# Altium schematic sheet Sheet3.SchDoc
size A3
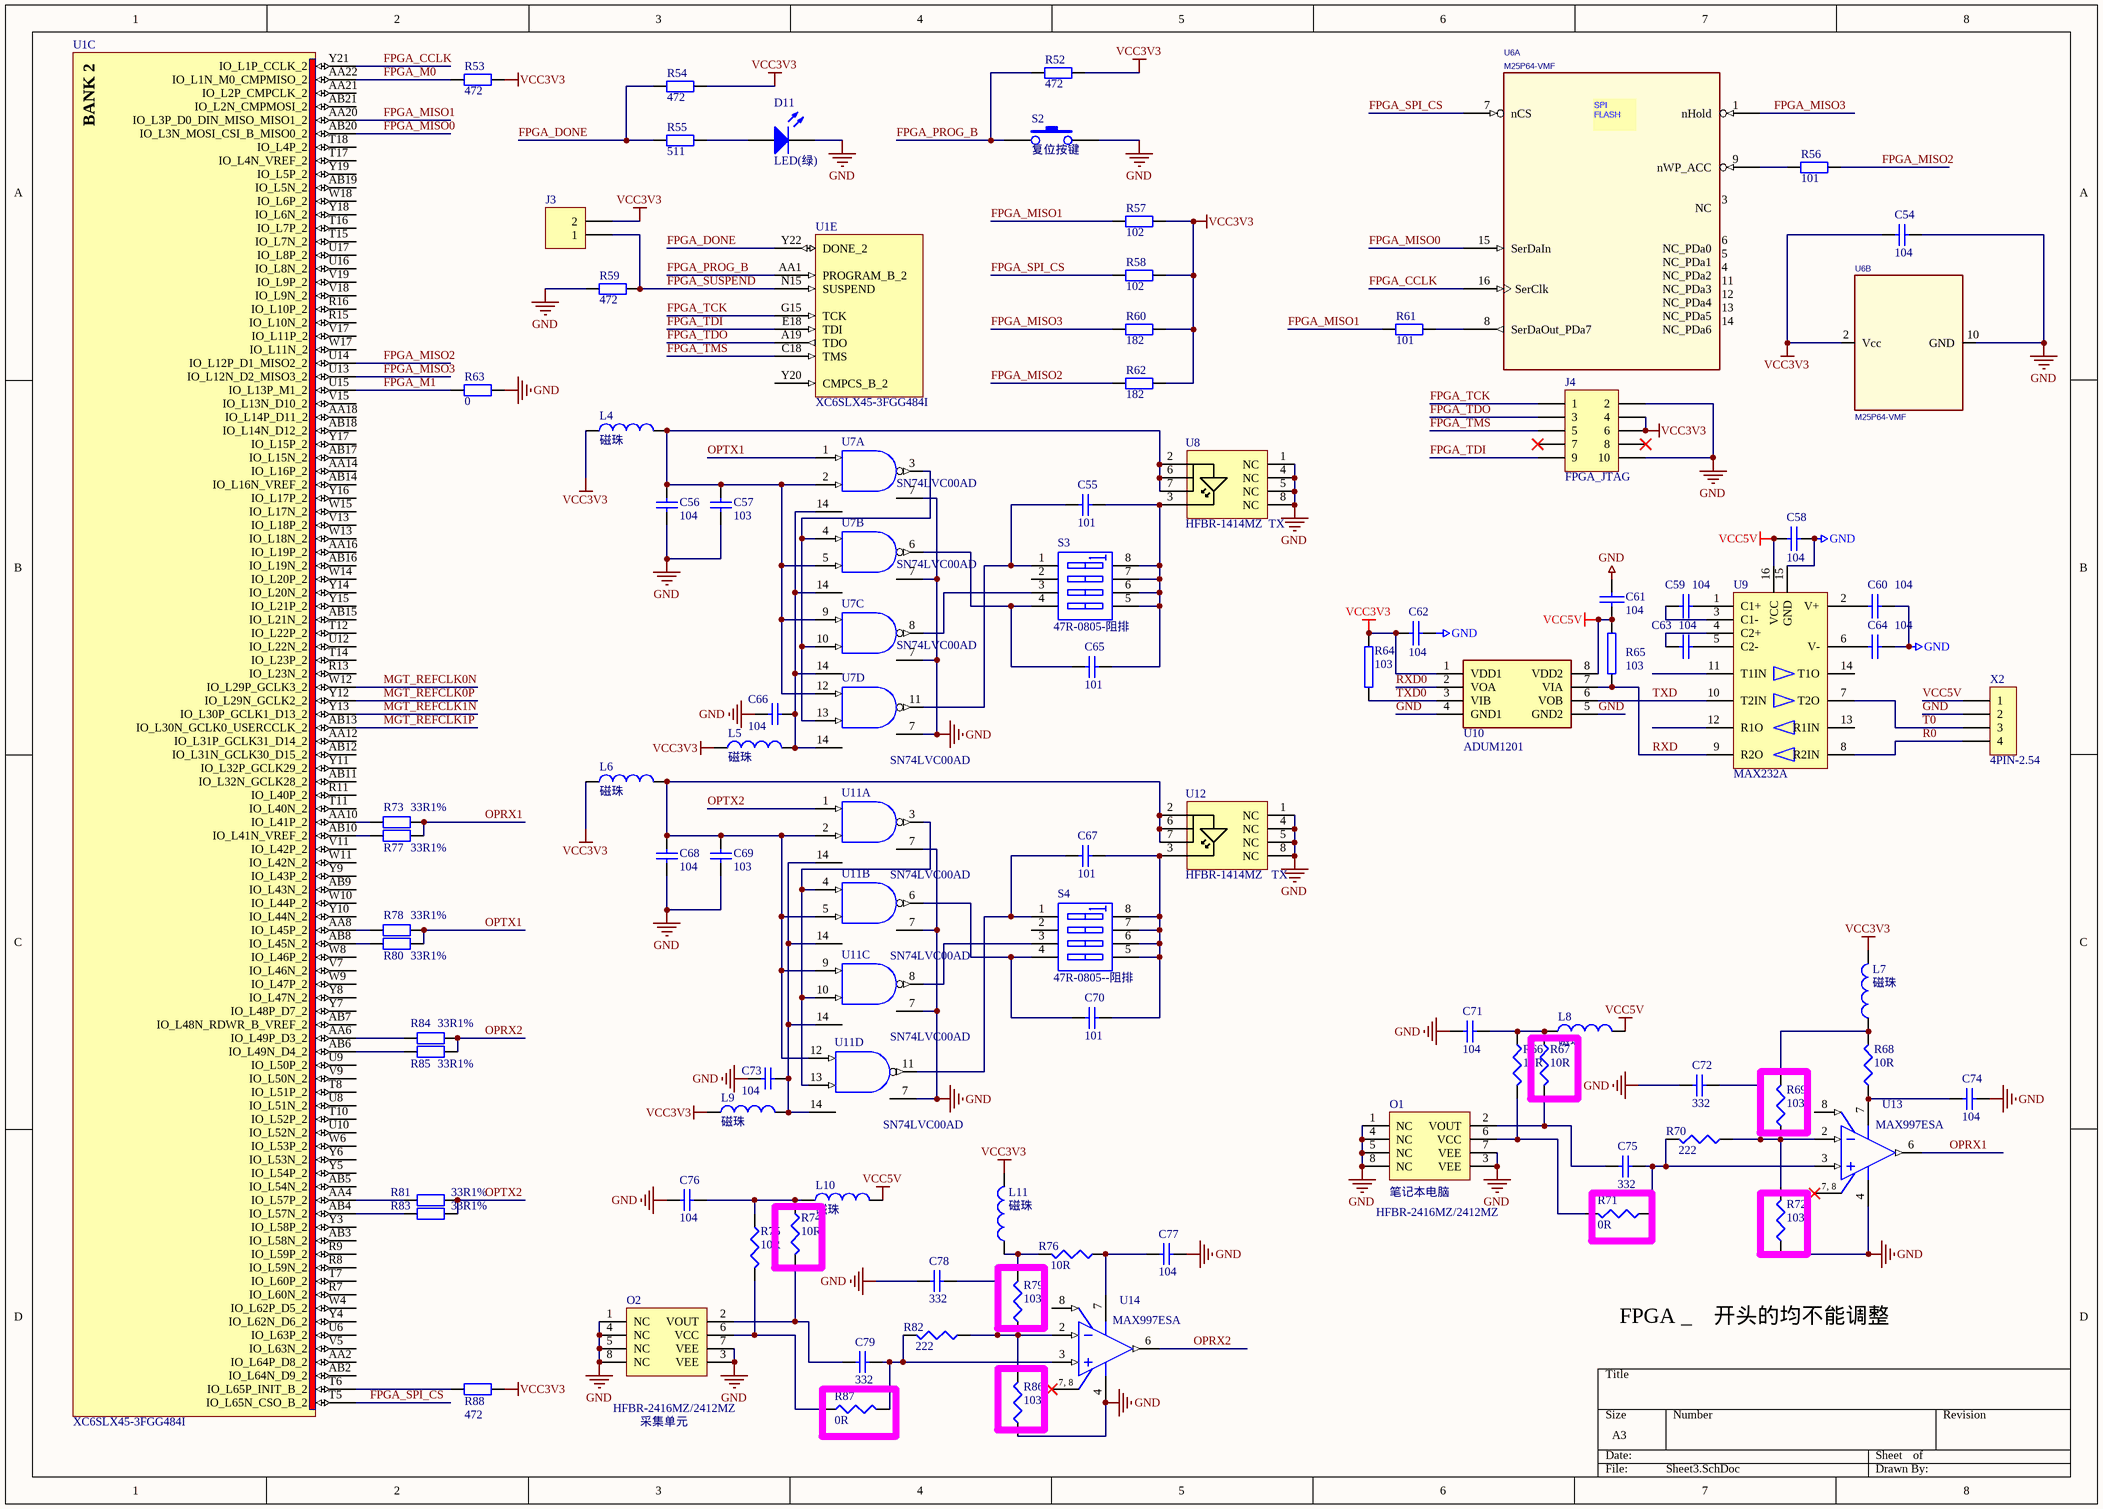
[diagram p0: Sheet3.SchDoc]

## Parts
C54  104  [0402]
C55  101  [0603]
C56  104  [0603]
C57  103  [0603]
C58  104  [0603]
C59  104  [0603]
C60  104  [0603]
C61  104  [0603]
C62  104  [0603]
C63  104  [0603]
C64  104  [0603]
C65  101  [0603]
C66  104  [0603]
C67  101  [0603]
C68  104  [0603]
C69  103  [0603]
C70  101  [0603]
C71  104  [0603]
C72  332  [0603]
C73  104  [0603]
C74  104  [0603]
C75  332  [0603]
C76  104  [0603]
C77  104  [0603]
C78  332  [0603]
C79  332  [0603]
D11  LED(绿)  [0805LED]
J3  (no value)  [HDR1X2]
J4  FPGA_JTAG  [HDR2X5]
L4  磁珠  [1206A]
L5  磁珠  [1206A]
L6  磁珠  [1206A]
L7  磁珠  [1206A]
L8  磁珠  [1206A]
L9  磁珠  [1206A]
L10  磁珠  [1206A]
L11  磁珠  [1206A]
O1  HFBR-2416MZ/2412MZ  [OPT]
O2  HFBR-2416MZ/2412MZ  [OPT]
R52  472  [0603]
R53  472  [0603]
R54  472  [0603]
R55  511  [0603]
R56  101  [0603]
R57  102  [0603]
R58  102  [0603]
R59  472  [0603]
R60  182  [0603]
R61  101  [0603]
R62  182  [0603]
R63  0  [0603]
R64  103  [0603]
R65  103  [0603]
R66  10R  [0603]
R67  10R  [0603]
R68  10R  [0603]
R69  103  [0603]
R70  222  [0603]
R71  0R  [0603]
R72  103  [0603]
R73  33R1%  [0402]
R74  10R  [0603]
R75  10R  [0603]
R76  10R  [0603]
R77  33R1%  [0402]
R78  33R1%  [0402]
R79  103  [0603]
R80  33R1%  [0402]
R81  33R1%  [0402]
R82  222  [0603]
R83  33R1%  [0402]
R84  33R1%  [0402]
R85  33R1%  [0402]
R86  103  [0603]
R87  0R  [0603]
R88  472  [0603]
S2  复位按键  [RESETKEY]
S3  47R-0805-阻排  [RNS001]
S4  47R-0805--阻排  [RNS001]
U1  XC6SLX45-3FGG484I  [FGG484]  (parts C,E of 8)
U6  M25P64-VMF  [SOIC16]  (parts A,B of 2)
U7  SN74LVC00AD  [SMD14X]  (parts A,B,C,D of 4)
U8  HFBR-1414MZ  TX  [OPT]
U9  MAX232A  [SMD16XX]
U10  ADUM1201  [SMD8XX]
U11  SN74LVC00AD  [SMD14X]  (parts A,B,C,D of 4)
U12  HFBR-1414MZ   TX  [OPT]
U13  MAX997ESA  [SMD8XX]
U14  MAX997ESA  [SMD8XX]
X2  4PIN-2.54  [SIP4X]

## Nets
GND: C54.1 C56.2 C57.1 C58.1 C60.1 C61.2 C62.2 C64.1 C66.2 C68.2 C69.1 C71.2 C72.2 C73.2 C74.2 C76.2 C77.2 C78.2 D11.2(K) J4.2 J4.10 O1.1(NC) O1.3(VEE) O1.4(NC) O1.5(NC) O1.7(VEE) O1.8(NC) O2.1(NC) O2.3(VEE) O2.4(NC) O2.5(NC) O2.7(VEE) O2.8(NC) R59.1 R63.2 R72.1 R86.1 S2.2 U6.10(GND) U7.7(GND) U8.1(NC) U8.4(NC) U8.5(NC) U8.8(NC) U9.15(GND) U10.4(GND1) U10.5(GND2) U11.7(GND) U12.1(NC) U12.4(NC) U12.5(NC) U12.8(NC) U13.4(GND) U14.4(GND) X2.2
VCC: C66.1 C73.1 L5.2 L9.2 U7.14(VCC) U11.14(VCC)
VCC3V3: C54.2 C62.1 J3.2 J4.4 J4.6 L4.1 L5.1 L6.1 L7.2 L9.1 L11.2 R52.2 R53.2 R54.2 R57.2 R58.2 R60.2 R62.2 R64.2 R88.2 U6.2(Vcc) U10.1(VDD1)
VCC5V: C58.2 C61.1 L8.2 L10.2 R65.2 U9.16(VCC) U10.8(VDD2) X2.1
FPGA_CCLK: U1.Y21(IO_L1P_CCLK_2) U6.16(SerClk)
FPGA_DONE: R54.1 R55.1 U1.Y22(DONE_2)
FPGA_M0: R53.1 U1.AA22(IO_L1N_M0_CMPMISO_2)
FPGA_M1: R63.1 U1.U15(IO_L13P_M1_2)
FPGA_MISO0: U1.AB20(IO_L3N_MOSI_CSI_B_MISO0_2) U6.15(SerDaIn)
FPGA_MISO1: R57.1 R61.1 U1.AA20(IO_L3P_D0_DIN_MISO_MISO1_2)
FPGA_MISO2: R56.2 R62.1 U1.U14(IO_L12P_D1_MISO2_2)
FPGA_MISO3: R60.1 U1.U13(IO_L12N_D2_MISO3_2) U6.1(nHold)
FPGA_PROG_B: R52.1 S2.1 U1.AA1(PROGRAM_B_2)
FPGA_SPI_CS: R58.1 U1.T5(IO_L65N_CSO_B_2) U6.7(nCS)
FPGA_SUSPEND: J3.1 R59.2 U1.N15(SUSPEND)
FPGA_TCK: J4.1 U1.G15(TCK)
FPGA_TDI: J4.9 U1.E18(TDI)
FPGA_TDO: J4.3 U1.A19(TDO)
FPGA_TMS: J4.5 U1.C18(TMS)
MGT_REFCLK0N: U1.W12(IO_L29P_GCLK3_2)
MGT_REFCLK0P: U1.Y12(IO_L29N_GCLK2_2)
MGT_REFCLK1N: U1.Y13(IO_L30P_GCLK1_D13_2)
MGT_REFCLK1P: U1.AB13(IO_L30N_GCLK0_USERCCLK_2)
OPRX1: R73.1 R77.1 U13.6(OUT)
OPRX2: R84.1 R85.1 U14.6(OUT)
OPTX1: R78.1 R80.1 U7.1(A)
OPTX2: R81.1 R83.1 U11.1(A)
R0: U9.8(R2IN) X2.4
RXD: R65.1 U9.9(R2O) U10.7(VIA)
RXD0: U10.2(VOA)
T0: U9.7(T2O) X2.3
TXD: U9.10(T2IN) U10.6(VOB)
TXD0: R64.1 U10.3(VIB)
NetC55_1: C55.1 C65.1 S3.5(B4) S3.6(B3) S3.7(B2) S3.8(B1) U8.3
NetC55_2: C55.2 S3.1(A1) U7.11(Y)
NetC56_1: C56.1 C57.2 L4.2 U7.2(B) U7.5(B) U7.9(A) U7.12(A) U8.2 U8.6 U8.7
NetC59_1: C59.1 U9.1(C1+)
NetC59_2: C59.2 U9.3(C1-)
NetC60_2: C60.2 U9.2(V+)
NetC63_1: C63.1 U9.5(C2-)
NetC63_2: C63.2 U9.4(C2+)
NetC64_2: C64.2 U9.6(V-)
NetC65_2: C65.2 S3.4(A4) U7.6(Y)
NetC67_1: C67.1 C70.1 S4.5(B4) S4.6(B3) S4.7(B2) S4.8(B1) U12.3
NetC67_2: C67.2 S4.1(A1) U11.11(Y)
NetC68_1: C68.1 C69.2 L6.2 U11.2(B) U11.5(B) U11.9(A) U11.12(A) U12.2 U12.6 U12.7
NetC70_2: C70.2 S4.4(A4) U11.6(Y)
NetC71_1: C71.1 L8.1 R66.1 R67.1
NetC72_1: C72.1 R69.1 R70.1 R72.2 U13.2(IN-)
NetC74_1: C74.1 R68.1 U13.7(VCC)
NetC75_1: C75.1 R70.2 R71.1 U13.3(IN+)
NetC75_2: C75.2 O1.2(VOUT) R67.2
NetC76_1: C76.1 L10.1 R74.1 R75.1
NetC77_1: C77.1 R76.1 U14.7(VCC)
NetC78_1: C78.1 R79.1 R82.1 R86.2 U14.2(IN-)
NetC79_1: C79.1 R82.2 R87.2 U14.3(IN+)
NetC79_2: C79.2 O2.2(VOUT) R74.2
NetD11_1: D11.1(A) R55.2
NetL7_1: L7.1 R68.2 R69.2
NetL11_1: L11.1 R76.2 R79.2
NetO1_6: O1.6(VCC) R66.2 R71.2
NetO2_6: O2.6(VCC) R75.2 R87.1
NetR56_1: R56.1 U6.9(nWP_ACC)
NetR61_2: R61.2 U6.8(SerDaOut_PDa7)
NetR73_2: R73.2 U1.AA10(IO_L41P_2)
NetR77_2: R77.2 U1.AB10(IO_L41N_VREF_2)
NetR78_2: R78.2 U1.AA8(IO_L45P_2)
NetR80_2: R80.2 U1.AB8(IO_L45N_2)
NetR81_2: R81.2 U1.AA4(IO_L57P_2)
NetR83_2: R83.2 U1.AB4(IO_L57N_2)
NetR84_2: R84.2 U1.AA6(IO_L49P_D3_2)
NetR85_2: R85.2 U1.AB6(IO_L49N_D4_2)
NetR88_1: R88.1 U1.T6(IO_L65P_INIT_B_2)
NetS3_3: S3.3(A3) U7.8(Y)
NetS4_3: S4.3(A3) U11.8(Y)
NetU7_3: U7.3(Y) U7.4(A) U7.10(B) U7.13(B)
NetU11_3: U11.3(Y) U11.4(A) U11.10(B) U11.13(B)
NetU13_1: U13.1(NC) U13.5(NC)
NetU14_1: U14.1(NC) U14.5(NC)

Not connected (* = marked no-connect by the designer): J4 7* 8*; S3 2(A2); S4 2(A2); U1 AA2(IO_L64P_D8_2) AA12(IO_L31P_GCLK31_D14_2) AA14(IO_L16P_2) AA16(IO_L19P_2) AA18(IO_L14P_D11_2) AA21(IO_L2P_CMPCLK_2) AB2(IO_L64N_D9_2) AB3(IO_L58N_2) AB5(IO_L54N_2) AB7(IO_L48N_RDWR_B_VREF_2) AB9(IO_L43N_2) AB11(IO_L32N_GCLK28_2) AB12(IO_L31N_GCLK30_D15_2) AB14(IO_L16N_VREF_2) AB15(IO_L21N_2) AB16(IO_L19N_2) AB17(IO_L15N_2) AB18(IO_L14N_D12_2) AB19(IO_L5N_2) AB21(IO_L2N_CMPMOSI_2) R7(IO_L60N_2) R8(IO_L59N_2) R9(IO_L59P_2) R11(IO_L40P_2) R13(IO_L23N_2) R15(IO_L10N_2) R16(IO_L10P_2) T7(IO_L60P_2) T8(IO_L51P_2) T10(IO_L52P_2) T11(IO_L40N_2) T12(IO_L22P_2) T14(IO_L23P_2) T15(IO_L7N_2) T16(IO_L7P_2) T17(IO_L4N_VREF_2) T18(IO_L4P_2) U6(IO_L63P_2) U8(IO_L51N_2) U9(IO_L50P_2) U10(IO_L52N_2) U12(IO_L22N_2) U16(IO_L8N_2) U17(IO_L8P_2) V5(IO_L63N_2) V7(IO_L46N_2) V9(IO_L50N_2) V11(IO_L42P_2) V13(IO_L18P_2) V15(IO_L13N_D10_2) V17(IO_L11P_2) V18(IO_L9N_2) V19(IO_L9P_2) W4(IO_L62P_D5_2) W6(IO_L53P_2) W8(IO_L46P_2) W9(IO_L47P_2) W10(IO_L44P_2) W11(IO_L42N_2) W13(IO_L18N_2) W14(IO_L20P_2) W15(IO_L17N_2) W17(IO_L11N_2) W18(IO_L6P_2) Y3(IO_L58P_2) Y4(IO_L62N_D6_2) Y5(IO_L54P_2) Y6(IO_L53N_2) Y7(IO_L48P_D7_2) Y8(IO_L47N_2) Y9(IO_L43P_2) Y10(IO_L44N_2) Y11(IO_L32P_GCLK29_2) Y14(IO_L20N_2) Y15(IO_L21P_2) Y16(IO_L17P_2) Y17(IO_L15P_2) Y18(IO_L6N_2) Y19(IO_L5P_2) Y20(CMPCS_B_2); U6 3(NC) 4(NC_PDa2) 5(NC_PDa1) 6(NC_PDa0) 11(NC_PDa3) 12(NC_PDa4) 13(NC_PDa5) 14(NC_PDa6); U9 11(T1IN) 12(R1O) 13(R1IN) 14(T1O); U13 8(~{SHDN}); U14 8(~{SHDN})

## Notes on the sheet
- (near O1) 笔记本电脑
- FPGA _    开头的均不能调整
- 采集单元
- (in symbol MAX998ESA) 7, 8
- (in symbol SPI FLASH 128Mb S25FL128P, part A) SPI / FLASH
- (in symbol XC6SLX45-3FGG484I, part C) BANK 2

## Library data of the parts
C54 C66 C73 C74 C77 = Cap: Capacitor; Value: 0.1uF; Published: 8-Jun-2000; LatestRevisionDate: 17-Jul-2002; LatestRevisionNote: Re-released for DXP Platform.; PackageReference: RAD-0.3; Publisher: Altium Limited
C55 C65 C67 C70 = Cap Semi: Capacitor (Semiconductor SIM Model); Value: ?uF; Published: 8-Jun-2000; LatestRevisionDate: 29-May-2009; LatestRevisionNote: IPC-7351 Footprint Added.; PackageReference: C1206; Publisher: Altium Limited; PackageDescription: Chip Capacitor
C56 C57 C68 C69 = Cap Semi: Capacitor (Semiconductor SIM Model); Value: ?pF; Published: 8-Jun-2000; LatestRevisionDate: 29-May-2009; LatestRevisionNote: IPC-7351 Footprint Added.; PackageReference: C1206; Publisher: Altium Limited; PackageDescription: Chip Capacitor
C58-C64 = CAP: Capacitor
C71 C72 C75 C76 C78 C79 = Cap: Capacitor; Value: ?pF; Published: 8-Jun-2000; LatestRevisionDate: 17-Jul-2002; LatestRevisionNote: Re-released for DXP Platform.; PackageReference: RAD-0.3; Publisher: Altium Limited
D11 = LED0: Typical INFRARED GaAs LED; Published: 8-Jun-2000; LatestRevisionDate: 08-Jul-2005; LatestRevisionNote: Mech Layer 1 removed.; PackageReference: LED-0; Publisher: Altium Limited
J3 = Header 2: Header, 2-Pin; LatestRevisionDate: 17-Jul-2002; LatestRevisionNote: Re-released for DXP Platform.; Publisher: Altium Limited
J4 = Header 5X2: Header, 5-Pin, Dual row; LatestRevisionDate: 17-Jul-2002; LatestRevisionNote: Re-released for DXP Platform.; Publisher: Altium Limited
L4-L11 = Inductor: Code_IEC: 1005; Value: 1uH 磁珠; Published: 8-Jun-2000; LatestRevisionDate: 29-May-2009; LatestRevisionNote: IPC-7351 Footprint Added.; PackageReference: 0402-A; Publisher: Altium Limited; PackageDescription: Chip Inductor; Code_JEITA: 0402
O1 O2 = OPTO
R52-R54 R59 R63 R88 = Res2: Resistor; Value: 4K7; Published: 8-Jun-2000; LatestRevisionDate: 17-Jul-2002; LatestRevisionNote: Re-released for DXP Platform.; PackageReference: AXIAL-0.4; Publisher: Altium Limited
R55 = Res2: Resistor; Value: 510; Published: 8-Jun-2000; LatestRevisionDate: 17-Jul-2002; LatestRevisionNote: Re-released for DXP Platform.; PackageReference: AXIAL-0.4; Publisher: Altium Limited
R56 R61 = Res2: Resistor; Value: 100R; Published: 8-Jun-2000; LatestRevisionDate: 17-Jul-2002; LatestRevisionNote: Re-released for DXP Platform.; PackageReference: AXIAL-0.4; Publisher: Altium Limited
R57 = Res2: Resistor; Value: DNP; Published: 8-Jun-2000; LatestRevisionDate: 17-Jul-2002; LatestRevisionNote: Re-released for DXP Platform.; PackageReference: AXIAL-0.4; Publisher: Altium Limited
R58 = Res2: Resistor; Value: 1K; Published: 8-Jun-2000; LatestRevisionDate: 17-Jul-2002; LatestRevisionNote: Re-released for DXP Platform.; PackageReference: AXIAL-0.4; Publisher: Altium Limited
R60 R62 = Res2: Resistor; Value: 1.8K; Published: 8-Jun-2000; LatestRevisionDate: 17-Jul-2002; LatestRevisionNote: Re-released for DXP Platform.; PackageReference: AXIAL-0.4; Publisher: Altium Limited
R64 R65 = RES2
R66-R68 R74-R76 = Res3: Resistor; Published: 8-Jun-2000; LatestRevisionDate: 29-May-2009; LatestRevisionNote: IPC-7351 Footprint Added.; PackageReference: J1-0603; Publisher: Altium Limited; PackageDescription: Chip Resistor; Value: 10R
R69 R71 R72 R79 R86 R87 = Res3: Resistor; Value: 10R; Published: 8-Jun-2000; LatestRevisionDate: 29-May-2009; LatestRevisionNote: IPC-7351 Footprint Added.; PackageReference: J1-0603; Publisher: Altium Limited; PackageDescription: Chip Resistor
R70 R82 = Res3: Resistor; Value: 2.2K; Published: 8-Jun-2000; LatestRevisionDate: 29-May-2009; LatestRevisionNote: IPC-7351 Footprint Added.; PackageReference: J1-0603; Publisher: Altium Limited; PackageDescription: Chip Resistor
R73 R77 R78 R80 R81 R83-R85 = Res2: Resistor; Value: 33R; Published: 8-Jun-2000; LatestRevisionDate: 17-Jul-2002; LatestRevisionNote: Re-released for DXP Platform.; PackageReference: AXIAL-0.4; Publisher: Altium Limited
S2 = SW-PB
S3 S4 = SW DIP-4: DIP Switch, 4 Position, SPST; Published: 24-Mar-1999; LatestRevisionDate: 29-May-2009; LatestRevisionNote: IPC-7351 Footprint Added.; PackageVersion: Dec-2002; PackageReference: SO8; Publisher: Altium Limited; PackageDescription: 8-Pin Small Outline Integrated Circuit 1.27 mm Pitch; Code_JEDEC: MS-012-AA; Code_IPC: SOIC127P600-8
U1 = XC6SLX45-3FGG484I: Spartan-6 LX 1.2V FPGA, 316 User I/Os, 484-Ball Fine-Pitch BGA (1.0mm Pitch), Speed Grade 3, Industrial Grade, Pb-Free; FirstPublished: 17-Nov-2009; DatasheetVersion: ver1.3, Nov-2009; PackageVersion: ver1.1, Dec-2008; PackageReference: FGG484; Publisher: Altium Limited; PackageDescription: 484-Ball Fine Pitch Ball Grid Array 1.00 mm Pitch (FGG484) - Pb-Free; Code_JEDEC: MS-034-AAJ-1; Code_IPC: BGA100P22X22-484; ComponentLink1Description: Spartan-6 Datasheet; ComponentLink1URL: http://www.xilinx.com/support/documentation/data_sheets/ds160.pdf; ComponentLink2Description: Pinout Specification; ComponentLink2URL: http://www.xilinx.com/support/documentation/user_guides/ug385.pdf; ComponentLink3Description: FGG484 Package Drawing; ComponentLink3URL: http://www.xilinx.com/support/documentation/package_specs/fg484.pdf; ComponentLink4Description: Spartan-6 Documents; ComponentLink4URL: http://www.xilinx.com/support/documentation/spartan-6.htm; ComponentLink5Description: Xilinx.com Home; ComponentLink5URL: http://www.xilinx.com
U6 = SPI FLASH 128Mb S25FL128P: SPI FLASH 128Mbit, 104MHz, 64kB sector; Full Part No: S25FL128P0XMFI00; Manufacturer: Spansion; Volts: 3.3V; ALS Lib: L0505; CLASS: IC; Type: SPI; Case: SOIC16
U7 U11 = SN74LVC00AD: Quadruple 2-Input Positive-NAND Gate; Published: 8-Jun-2000; LatestRevisionDate: 13-Apr-2006; LatestRevisionNote: IPC-7351 Footprint Added.; DatasheetVersion: Jun-1998; PackageVersion: Jan-1998; PackageReference: D014; Publisher: Altium Limited; PackageDescription: 14-Pin Small Outline Integrated Circuit 1.27 mm Pitch; Code_IPC: SOIC127P600-14; ComponentLink1Description: Manufacturer Link; ComponentLink1URL: http://www.ti.com/; ComponentLink2Description: Datasheet; ComponentLink2URL: http://www-s.ti.com/sc/ds/SN54LVC00A.pdf
U8 U12 = HFBR-1414
U13 U14 = MAX998ESA: Single, SOT23, Single-Supply, High-Speed, Low-Power Comparator; Published: 23-Sep-2002; LatestRevisionDate: 13-Apr-2006; LatestRevisionNote: IPC-7351 Footprint Added.; DatasheetVersion: Rev 1; 1/98; PackageReference: NSO8; Publisher: Altium Limited; PackageDescription: 8-Pin Small Outline Integrated Circuit 1.27 mm Pitch; Code_JEDEC: MS-012-AA; Code_IPC: SOIC127P600-8; ComponentLink1Description: Manufacturer Link; ComponentLink1URL: http://www.maxim-ic.com/; ComponentLink2Description: Datasheet; ComponentLink2URL: http://pdfserv.maxim-ic.com/en/ds/MAX976-MAX998.pdf
X2 = CON4: Connector